# EAGLE design 526_outin_pico_lego (EAGLE 9.6.2)
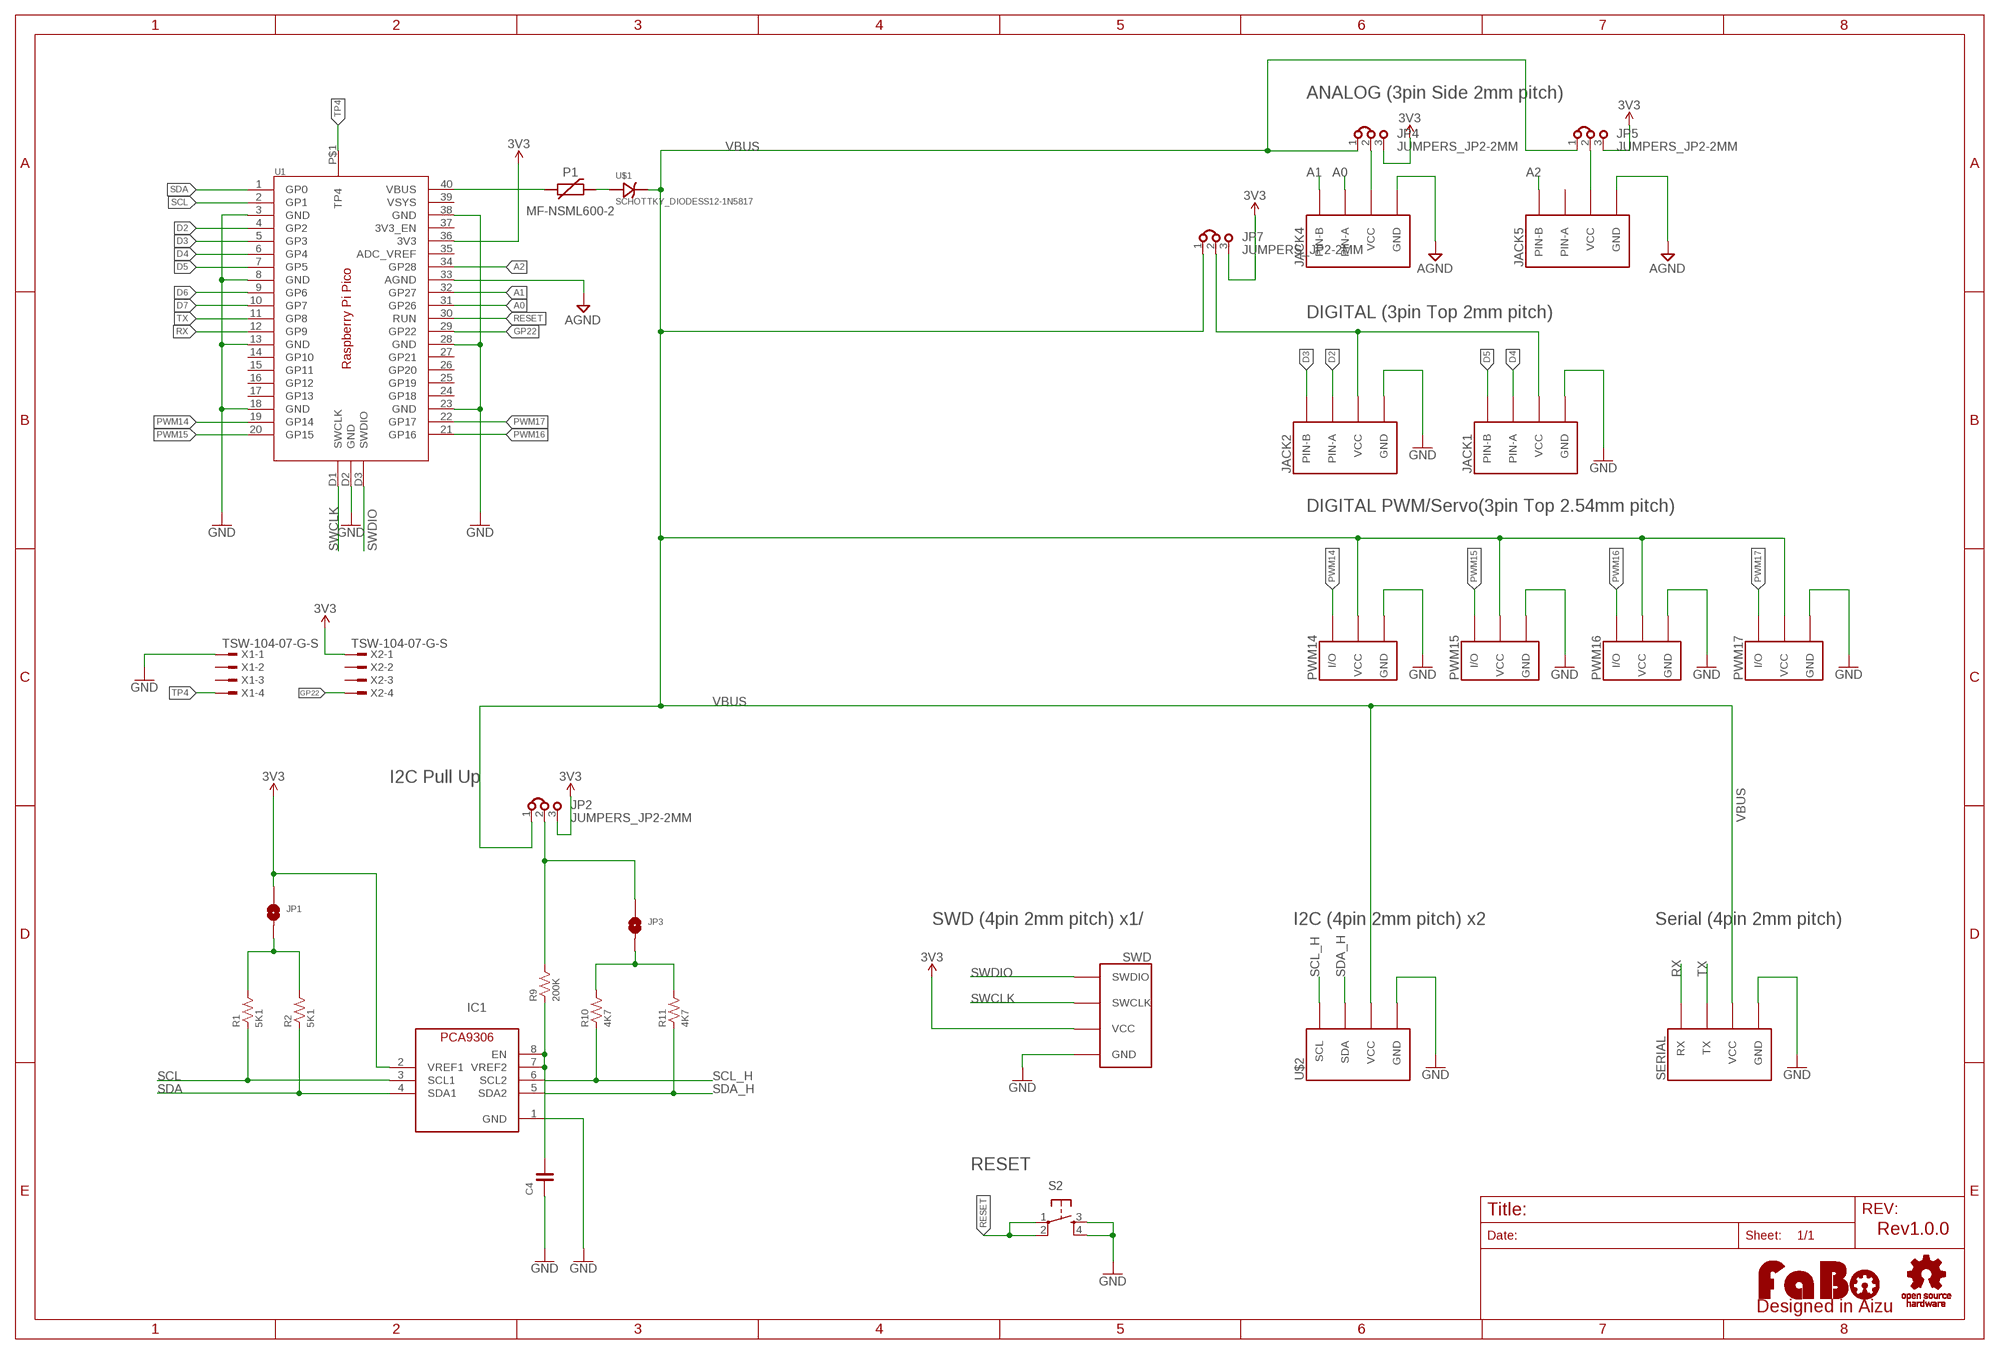
[diagram p0: schematic, sheet 1]

## Parts
C4  CAPACITOR-0603_NARROW  [0603-NARROW]
IC1  PCA9306_SSOP  [8PIN-SSOP]
JACK1  MODULAR-JACK-6P  [7002-6PXC-X]
JACK2  MODULAR-JACK-6P  [7002-6PXC-X]
JACK4  MODULAR-JACK-6P  [7002-6PXC-X]
JACK5  MODULAR-JACK-6P  [7002-6PXC-X]
JP1  SMD-JUMPER-2_SHORT  [SMD-JUMPER-2-SHORT]
JP2  JUMPERS_JP2-2MM  [JUMPERS_JP2-2MM]
JP3  SMD-JUMPER-2_SHORT  [SMD-JUMPER-2-SHORT]
JP4  JUMPERS_JP2-2MM  [JUMPERS_JP2-2MM]
JP5  JUMPERS_JP2-2MM  [JUMPERS_JP2-2MM]
JP7  JUMPERS_JP2-2MM  [JUMPERS_JP2-2MM]
LOGO1  LOGO_OSHW-M_BOTTOM  [LOGO_OSHW_M_BOTTOM]
LOGO2  LOGO_FABO-M  [LOGO_FABO_M]
P1  MF-NSML600-2  POLYSWITCH1206  [1206]
PWM14  FABO_BRICK_3PIN-HEADER  [FABO_BRICK_3PIN_HEADER]
PWM15  FABO_BRICK_3PIN-HEADER  [FABO_BRICK_3PIN_HEADER]
PWM16  FABO_BRICK_3PIN-HEADER  [FABO_BRICK_3PIN_HEADER]
PWM17  FABO_BRICK_3PIN-HEADER  [FABO_BRICK_3PIN_HEADER]
R1  5K1  RESISTOR-0603  [0603]
R2  5K1  RESISTOR-0603  [0603]
R9  200K  RESISTOR-0603  [0603]
R10  4K7  RESISTOR-0603  [0603]
R11  4K7  RESISTOR-0603  [0603]
S2  TACT-SWITCH-SMD_KMR2  [KMR2]
SERIAL  FABO_BRICK_SERIAL-S04B-PASK-2_LONG  [FABO_BRICK_SERIAL_S04B-PASK-2_LONG]
SWD  FABO-SWD-4PIN  [FABO_BRICK_SWD_B04B-PASK-1_SILK]
U1  RASPBERRY_PI_PICORASPBERRY_PI_PICO_SMD_PDM  [RASPBERRY_PI_PICO_SMD_PDM]
U$1  SCHOTTKY_DIODESS12-1N5817  [DO-214AC]
U$2  MODULAR-JACK-6P-I2C  [7002-6PXC-X]
X1  TSW-104-07-G-S  [TSW-104-XX-G-S]
X2  TSW-104-07-G-S  [TSW-104-XX-G-S]

## Nets
3V3: IC1.2(VREF1) JP1.1 JP2.3 JP4.3 JP5.3 JP7.3 SWD.VCC U1.36(3V3) X2.1
A0: JACK4.5(PIN-A) U1.31(GP26)
A1: JACK4.6(PIN-B) U1.32(GP27)
A2: JACK5.6(PIN-B) U1.34(GP28)
AGND: JACK4.1(GND) JACK5.1(GND) U1.33(AGND)
D2: JACK2.5(PIN-A) U1.4(GP2)
D3: JACK2.6(PIN-B) U1.5(GP3)
D4: JACK1.5(PIN-A) U1.6(GP4)
D5: JACK1.6(PIN-B) U1.7(GP5)
D6: U1.9(GP6)
D7: U1.10(GP7)
GND: C4.1 IC1.1(GND) JACK1.1(GND) JACK2.1(GND) PWM14.GND PWM15.GND PWM16.GND PWM17.GND S2.3 S2.4 SERIAL.GND SWD.GND U1.3(GND) U1.8(GND) U1.13(GND) U1.18(GND) U1.23(GND) U1.28(GND) U1.38(GND) U1.D2(GND) U$2.1(GND) X1.1
GP22: U1.29(GP22) X2.4
N$2: JACK5.3(VCC) JP5.2
N$3: JP1.2 R1.2 R2.2
N$4: JACK4.3(VCC) JP4.2
N$5: JACK1.3(VCC) JACK2.3(VCC) JP7.2
N$8: P1.P$2 U$1.CATHODE(ANODE)
N$10: JP2.2 JP3.1 R9.2
N$11: JP3.2 R10.2 R11.2
N$12: C4.2 IC1.7(VREF2) IC1.8(EN) R9.1
PWM14: PWM14.I/O U1.19(GP14)
PWM15: PWM15.I/O U1.20(GP15)
PWM16: PWM16.I/O U1.21(GP16)
PWM17: PWM17.I/O U1.22(GP17)
RESET: S2.1 S2.2 U1.30(RUN)
RX: SERIAL.RX U1.12(GP9)
SCL: IC1.3(SCL1) R1.1 U1.2(GP1)
SCL_H: IC1.6(SCL2) R10.1 U$2.4(SCL)
SDA: IC1.4(SDA1) R2.1 U1.1(GP0)
SDA_H: IC1.5(SDA2) R11.1 U$2.5(SDA)
SWCLK: SWD.SWCLK U1.D1(SWCLK)
SWDIO: SWD.SWDIO U1.D3(SWDIO)
TP4: U1.P$1(TP4) X1.4
TX: SERIAL.TX U1.11(GP8)
VBUS: JP2.1 JP4.1 JP5.1 JP7.1 PWM14.VCC PWM15.VCC PWM16.VCC PWM17.VCC SERIAL.VCC U$1.ANODE(CATHODE) U$2.3(VCC)
VS: P1.P$1 U1.40(VBUS)
Unconnected: JACK5.5(PIN-A) U1.14(GP10) U1.15(GP11) U1.16(GP12) U1.17(GP13) U1.24(GP18) U1.25(GP19) U1.26(GP20) U1.27(GP21) U1.35(ADC_VREF) U1.37(3V3_EN) U1.39(VSYS) X1.2 X1.3 X2.2 X2.3

## Notes on the sheet
- ANALOG (3pin Side 2mm pitch)
- DIGITAL (3pin Top 2mm pitch)
- DIGITAL PWM/Servo(3pin Top 2.54mm pitch)
- I2C Pull Up
- SWD (4pin 2mm pitch) x1/ | I2C (4pin 2mm pitch) x2 | Serial (4pin 2mm pitch)
- RESET
- Rev1.0.0

## Library data of the parts
C4 = FaBo-Capacitor:CAPACITOR: CAPACITOR
IC1 = FaBo-LevelTranslator:PCA9306
JACK1 JACK2 JACK4 JACK5 = FaBo-Connetor:MODULAR-JACK-6P
JP1 JP3 = FaBo-PIN:SMD-JUMPER-2
JP2 JP4 JP5 JP7 = 52101-101-REV-A_v16:JUMPERS_JP2-: Jumper/Bridge
LOGO1 = FaBo-Logo:LOGO_OSHW
LOGO2 = FaBo-Logo:LOGO_FABO
P1 = FaBo-Supply:POLYSWITCH
PWM14-PWM17 = FaBo-Template:FABO_BRICK_3PIN: FaBo Brick 3pin
R1 R2 R9-R11 = FaBo-Resistors:RESISTOR: RESISTOR
S2 = FaBo-Switch:TACT-SWITCH: Part No Maker Datasheet Distributor 1273HA-160G-G SWITRONIC Catalog <http://www.switronic.com/uploads/images/A10.gif> Akizuki <http://akizukidenshi.com/catalog/g/gP-02561/> DTS-6-V Cosland DTS 6 Series <http://www.cosland.com/newproduct/DTS%20SERIES.pdf> Akizuki <http://akizukidenshi.com/catalog/g/gP-03647/> KMR2 C&K KMR2 SERIES <https://www.ckswitches.com/products/switches/product-details/Tactile/KMR2/> Octoparts Result <https://octopart.com/search?q=KMR2&start=0> TSHA-T-XB2-19E TOP UP INDUSTORY TSHA-T <http://www.top-up.com.tw/front/bin/ptdetail.phtml?Part=TSHA-T> Akizuki <http://akizukidenshi.com/catalog/g/gP-09361/>
SERIAL = FaBo-Template:FABO_BRICK_SERIAL: FaBo Brick Serial
SWD = FaBo-Connetor:FABO-SWD-4PIN
U1 = FaBo-Boards:RASPBERRY_PI_PICO
U$1 = FaBo-Diode:SCHOTTKY_DIODE
U$2 = FaBo-Connetor:MODULAR-JACK-6P-I2C
X1 X2 = con-samtec:TSW-104-*-G-S: THROUGH-HOLE .025" SQ POST HEADER Source: Samtec TSW.pdf; MF: Samtec Inc.; MPN: TSW-104-07-G-S

## Board
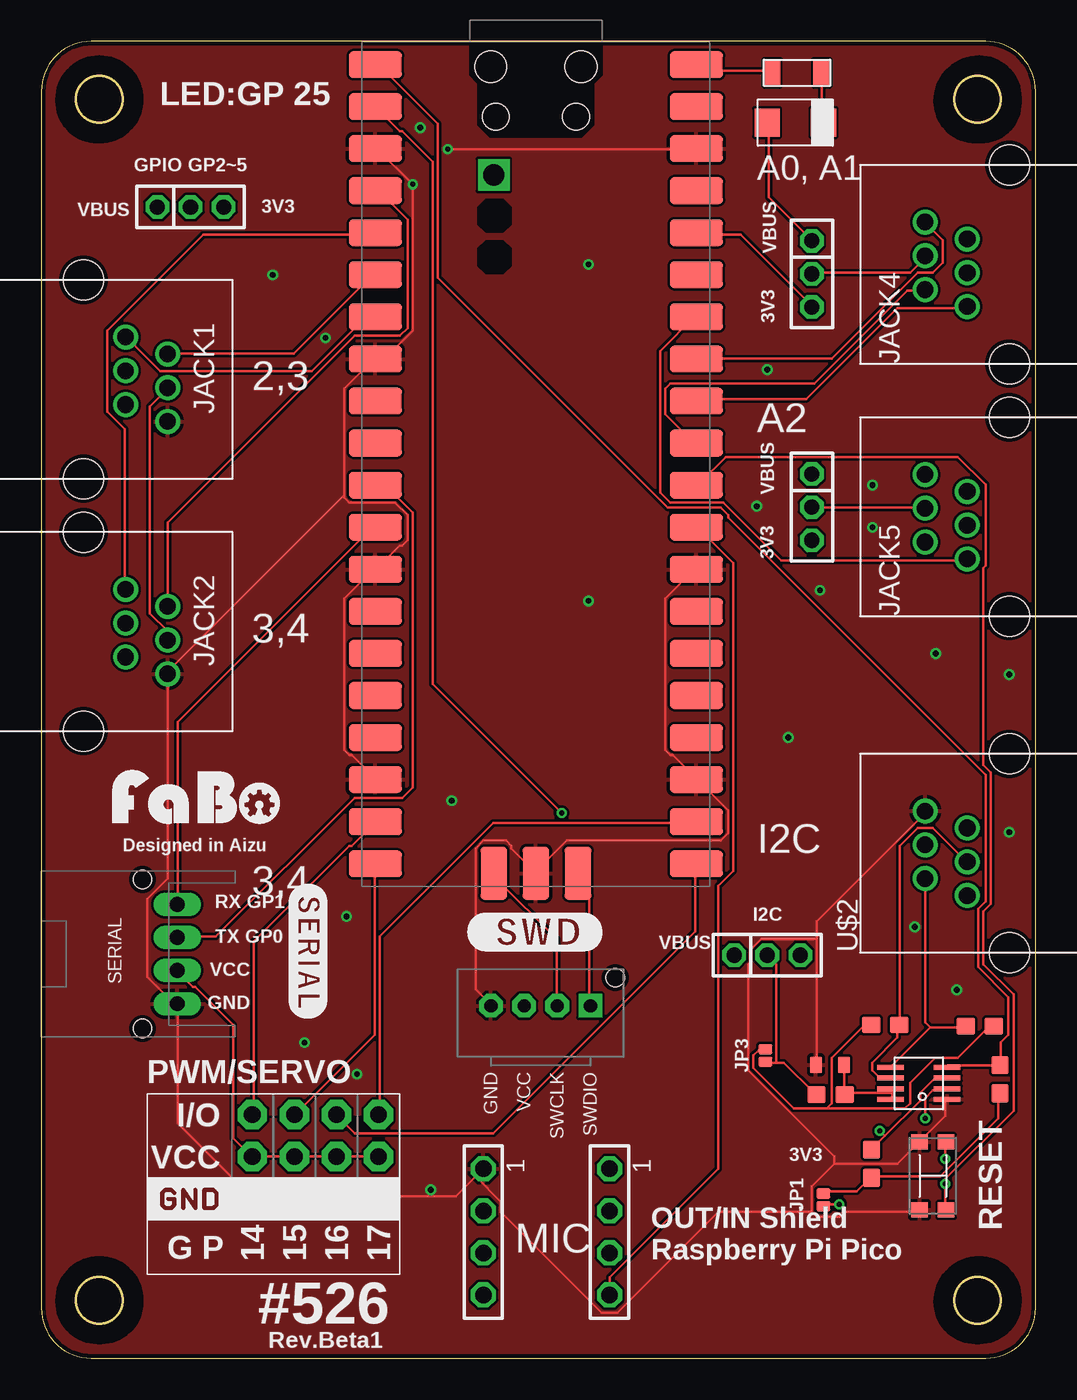
[diagram p1: board, top side]
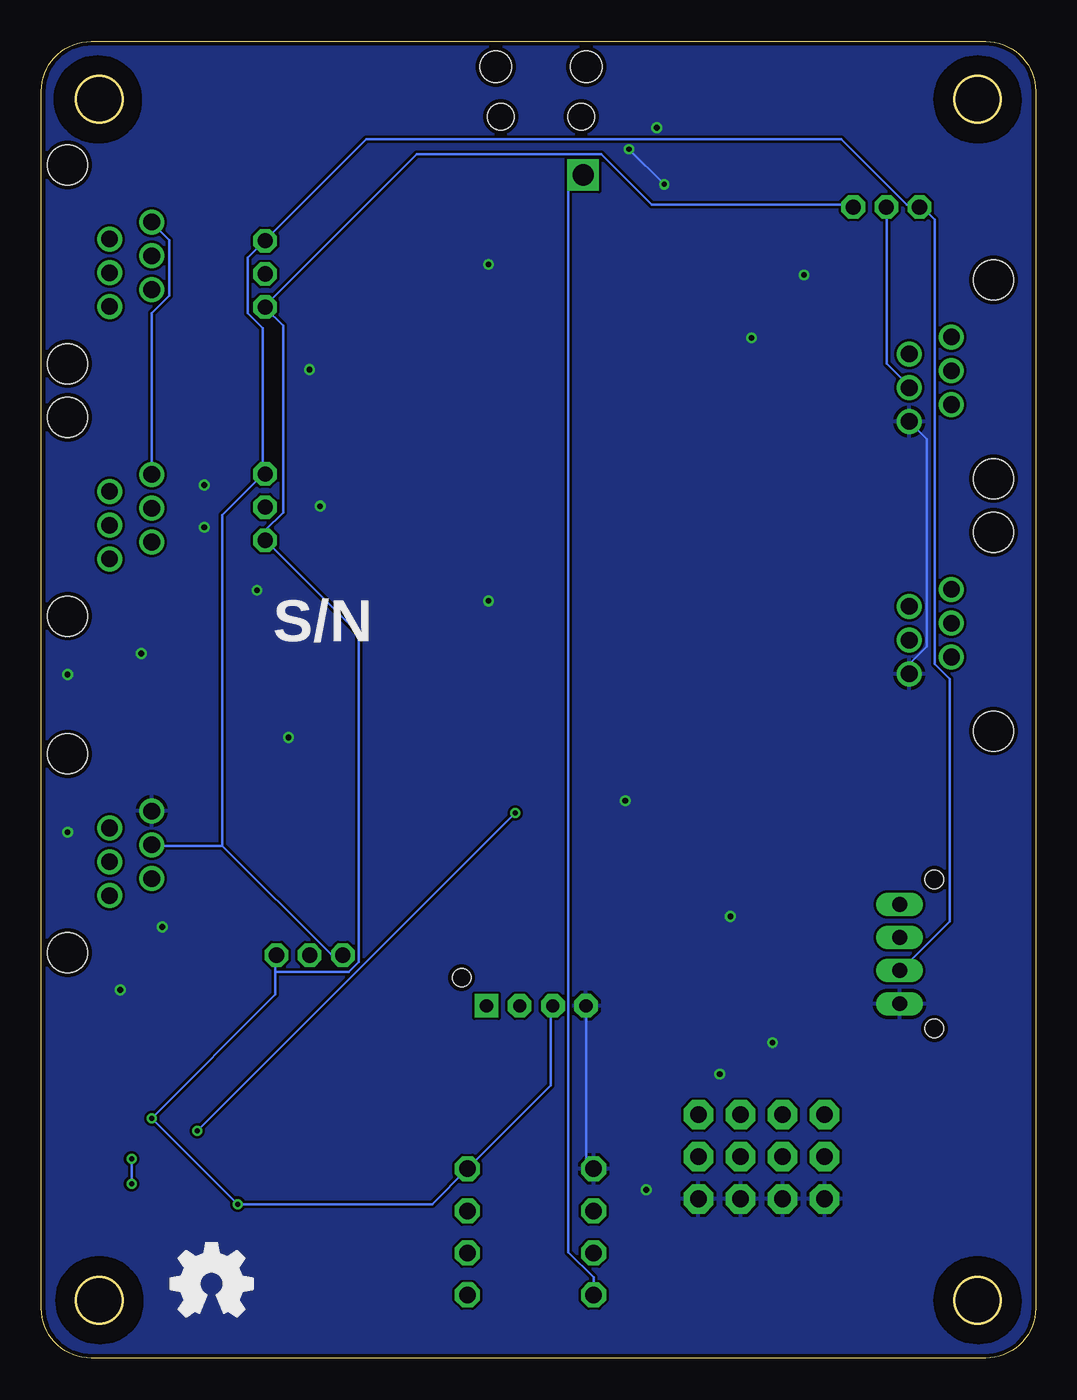
[diagram p2: board, bottom side, seen from below]

Size 60 x 79.5 mm. Coordinates in mm from the lower left corner, seen from the top.
Outline: 57,79.5 3,79.5 arc90 0,76.5 0,3 arc90 3,0 57,0 arc90 60,3 60,76.5 arc90 57,79.5
Outline: circle at 3.5,76 radius 1.4
Outline: circle at 56.5,76 radius 1.4
Outline: circle at 3.5,3.5 radius 1.4
Outline: circle at 56.5,3.5 radius 1.4
Copper layers (1*16): Top 0.035mm / dielectric 1.6mm / Bottom 0.035mm
Design rules "PCBway": minimum track width 6mil, minimum drill 12mil, track to track 6mil, track to pad 6mil, pad to pad 6mil, via to via 6mil, smd to smd 6mil, copper to edge 10mil, drill to drill 10mil, minimum pad ring 10mil, minimum via ring 6mil, stop-mask expansion 2mil, vias tented up to drill 100mil, thermal gap 8mil
tRestrict: area 53.9,0.9 to 59.1,6.1; area 53.9,73.4 to 59.1,78.6; area 0.9,73.4 to 6.1,78.6; area 0.9,0.9 to 6.1,6.1; 2 lines
bRestrict: area 53.9,0.9 to 59.1,6.1; area 0.9,73.4 to 6.1,78.6; area 54,73.4 to 59.2,78.6; area 0.9,0.9 to 6.1,6.1

### Footprints (pad centres in the part's own frame; a part is rotated, then mirrored left to right if it is on the bottom)
0603-NARROW = smd 0.71 x 1: 1 -0.85,0; 2 0.85,0
8PIN-SSOP = smd 0.3 x 1.6: 1 -0.975,-1.7; 2 -0.325,-1.7; 3 0.325,-1.7; 4 0.975,-1.7; 5 0.975,1.7; 6 0.325,1.7; 7 -0.325,1.7; 8 -0.975,1.7
7002-6PXC-X = drill 1: 1 2.55,5.08; 2 1.53,2.54; 3 0.51,5.08; 4 -0.51,2.54; 5 -1.53,5.08; 6 -2.55,2.54 | hole 2.4: -6,0; 6,0
SMD-JUMPER-2-SHORT = smd 0.61 x 0.838: 1 -0.381,0; 2 0.381,0
JUMPERS_JP2-2MM = drill 0.914 octagon: 1 -2,0; 2 0,0; 3 2,0
1206 = smd 1 x 1.6: P$1 -1.5,0; P$2 1.5,0
FABO_BRICK_3PIN_HEADER = drill 1 pad 1.778 octagon: GND -2.54,0; I/O 2.54,0; VCC 0,0
0603 = smd 1.1 x 1: 1 -0.85,0; 2 0.85,0
KMR2 = smd 0.9 x 1: 1 -2.05,0.8; 2 2.05,0.8; 3 2.05,-0.8; 4 -2.05,-0.8
FABO_BRICK_SERIAL_S04B-PASK-2_LONG = drill 0.9 pad 1.422 long: GND -3,0; RX 3,0; TX 1,0; VCC -1,0 | hole 1.1: 4.5,2.1; -4.5,2.1
FABO_BRICK_SWD_B04B-PASK-1_SILK = drill 0.8 pad 1.422 octagon: GND -3,0; SWCLK 1,0; VCC -1,0 | drill 0.8 pad 1.422 square: SWDIO 3,0 | hole 1.1: 4.5,1.7
RASPBERRY_PI_PICO_SMD_PDM = smd 3.2 x 1.6: 1 -9.69,25.4; 2 -9.69,22.86; 3 -9.69,20.32; 4 -9.69,17.78; 5 -9.69,15.24; 6 -9.69,12.7; 7 -9.69,10.16; 8 -9.69,7.62; 9 -9.69,5.08; 10 -9.69,2.54; 11 -9.69,0; 12 -9.69,-2.54; 13 -9.69,-5.08; 14 -9.69,-7.62; 15 -9.69,-10.16; 16 -9.69,-12.7; 17 -9.69,-15.24; 18 -9.69,-17.78; 19 -9.69,-20.32; 20 -9.69,-22.86; 21 9.69,-22.86; 22 9.69,-20.32; 23 9.69,-17.78; 24 9.69,-15.24; 25 9.69,-12.7; 26 9.69,-10.16; 27 9.69,-7.62; 28 9.69,-5.08; 29 9.69,-2.54; 30 9.69,0; 31 9.69,2.54; 32 9.69,5.08; 33 9.69,7.62; 34 9.69,10.16; 35 9.69,12.7; 36 9.69,15.24; 37 9.69,17.78; 38 9.69,20.32; 39 9.69,22.86; 40 9.69,25.4 | smd 1.6 x 3.2: D1 -2.54,-23.43; D2 0,-23.43; D3 2.54,-23.43 | drill 1.27 square: P$1 -2.54,18.733 | hole 1.9: 2.725,25.27; -2.725,25.27 | hole 1.6: 2.425,22.24; -2.425,22.24
DO-214AC = smd 1.52 x 1.68: ANODE 1.7,0; CATHODE -1.7,0
TSW-104-XX-G-S = drill 1 pad 1.5 octagon: 1 3.81,0; 2 1.27,0; 3 -1.27,0; 4 -3.81,0

### Placement (x,y rotation side)
C4  47.6,17.7 0 top
IC1  52.96,16.59 90 top
JACK1  2.54,59.1 270 top
JACK2  2.54,43.86 270 top
JACK4  58.42,66.04 90 top
JACK5  58.42,50.8 90 top
JP1  47.2,9.55 90 top
JP2  43.81,24.33 0 top
JP3  43.7,18.27 90 top
JP4  46.5,65.46 270 top
JP5  46.5,51.38 270 top
JP7  9,69.5 0 top
LOGO1  49.72,4.49 0 top
LOGO2  9.34,31.89 0 top
P1  45.6,77.6 0 top
PWM14  12.72,12.15 90 top
PWM15  15.27,12.15 90 top
PWM16  17.8,12.15 90 top
PWM17  20.34,12.15 90 top
R1  50.1,11.74 270 top
R2  57.86,16.84 270 top
R9  47.63,15.91 180 top
R10  50.93,20.12 180 top
R11  56.63,20.05 0 top
S2  53.8,11 270 top
SERIAL  8.2,24.4 90 top
SWD  30.14,21.27 0 top
U1  29.84,52.7 0 top
U$1  45.5,74.6 180 top
U$2  58.42,30.48 90 top
U$19  [LOGO_SILK_GND]  7.01,8.35 0 top
X1  26.67,7.62 90 top
X2  34.29,7.62 90 top

### Tracks (layer width: path | path; a pad name or v marks a point on that pad's centre or on a via)
3V3  (via drill 0.3)
  Top 0.152: v48.16,9.3 47.24,9.3 JP1.1 | v53.34,14.48 53.34,15.7 53.8,16.15 54.56,16.15 IC1.2 | U1.36 39.62,67.82 42.22,67.82 46.48,63.55 JP4.3
  Bottom 0.152: SWD.VCC 29.26,21.18 29.26,16.46 X2.1 36.42,9.3 v48.16,9.3 v53.34,14.48 45.87,21.95 45.87,23.32 | 45.87,23.32 45.87,24.23 JP2.3 | JP7.3 11.12,69.65 23.16,69.65 26.21,72.69 37.34,72.69 46.48,63.55 JP4.3 46.48,63.4 45.41,62.33 45.41,51.05 46.48,49.99 46.48,49.53 JP5.3 46.48,49.38 40.84,43.74 40.84,23.93 41.45,23.32 45.87,23.32
  pour Top (no thermals): 31.4,61.4 31.4,62.9 35.4,66.9 35.7,67.2 36.2,67.2 37.4,66 37.6,65.8 37.6,65.4 37.6,65.2 33.8,61.4 33.3,60.9 32,60.9 31.9,60.9
  pour Bottom (no thermals): 31.1,61.1 31.1,62.8 35.4,67.1 35.5,67.2 36.3,67.2 37.5,66 37.5,65.2 36.7,64.4 33,60.7 31.6,60.7 31.5,60.7
A0
  Top 0.152: JACK4.5 53.34,64.47 52.27,64.47 46.63,58.83 37.95,58.83 37.64,58.52 37.64,57 39.47,55.17 U1.31
A1
  Top 0.152: JACK4.6 55.78,63.4 51.66,63.4 46.18,57.91 39.62,57.91 U1.32
A2
  Top 0.152: JACK5.6 55.78,48.16 44.65,48.16 41.15,51.66 37.95,51.66 37.34,52.27 37.34,60.81 39.47,62.94 U1.34
AGND
  Top 0.152: U1.33 39.62,60.35 47.7,60.35 52.88,65.53 53.8,65.53 54.41,66.14 54.41,67.51 JACK4.1
  Bottom 0.152: JACK5.1 53.34,63.09 52.27,64.16 52.27,67.51 JACK4.1
D2
  Top 0.152: JACK2.5 7.62,50.44 18.9,61.72 21.64,61.72 22.1,62.18 22.1,68.73 20.27,70.56 U1.4
D3
  Top 0.152: JACK2.6 5.03,46.48 5.03,56.08 3.96,57.15 3.96,62.03 9.75,67.82 20.12,67.82 U1.5
D4
  Top 0.152: JACK1.5 7.62,60.66 15.24,60.66 20.12,65.53 U1.6
D5
  Top 0.152: JACK1.6 5.18,61.57 7.16,59.59 16.31,59.59 19.51,62.79 20.12,62.79 U1.7
GND  (via drill 0.3, 0.35)
  Top 0.152: U1.18 20.12,35.05 18.75,36.42 18.59,36.42 18.29,36.73 18.29,45.87 20.12,47.7 U1.13 20.27,47.7 21.64,49.07 21.79,49.07 22.1,49.38 22.1,50.9 21.34,51.66 18.59,51.66 18.29,51.97 18.29,52.12 | U1.3 20.27,73 v22.4,70.87 22.4,62.03 20.73,60.35 20.27,60.35 U1.8 20.12,60.35 18.29,58.52 18.29,52.12 | v24.54,73 39.47,73 U1.38 | 18.29,52.12 7.62,41.45 JACK2.1 7.62,28.96 6.4,27.74 6.4,23.01 8.08,21.34 SERIAL.GND 8.23,21.34 8.23,14.17 12.65,9.75 PWM14.GND 12.8,9.6 15.24,9.6 PWM15.GND 15.39,9.6 17.68,9.6 PWM16.GND 17.83,9.6 20.27,9.6 PWM17.GND 20.42,9.75 24.99,9.75 26.21,10.97 | 46.48,8.84 46.79,8.53 48.16,8.53 48.46,8.84 52.88,8.84 S2.3 | 46.48,8.84 46.48,10.36 47.85,11.73 | 47.85,11.73 51.66,11.73 52.88,12.95 S2.4 53.03,13.11 54.56,14.63 54.56,15.54 IC1.1 | 46.79,25.3 46.79,26.36 53.34,32.92 U$2.1 | 46.79,25.3 46.79,17.83 C4.1 | 47.85,11.73 47.85,12.19 42.67,17.37 42.67,23.77 42.82,23.93 42.82,24.69 43.43,25.3 46.79,25.3 | U1.28 39.47,47.7 37.64,45.87 37.64,36.73 37.95,36.42 38.1,36.42 39.47,35.05 U1.23 39.62,34.9 41.45,33.07 41.45,31.7 41,31.24 31.7,31.24 29.87,29.41 U1.D2 29.72,29.41 28.35,30.79 28.35,30.94 28.04,31.24 26.67,31.24 26.21,30.79 26.21,22.25 27.13,21.34 SWD.GND | 46.48,8.84 40.84,8.84 34.75,2.74 33.83,2.74 27.74,8.84 27.74,9.45 26.21,10.97 | 26.21,10.97 X1.1
  Bottom 0.152: JACK2.1 7.62,41.91 6.55,42.98 6.55,55.47 JACK1.1 | v22.4,70.87 v24.54,73 | X1.1 27.13,11.89 27.13,21.18 SWD.GND
  other vias: 33.02,45.72 45.09,37.47 24.77,33.66 18.41,26.67 46.99,46.35 13.97,65.41 33.02,66.04 55.24,22.23 52.7,26.04 58.42,31.75 58.42,41.27 53.98,42.55 50.16,50.16 50.16,52.7 43.18,51.44 19.05,17.14 15.88,19.05 23.5,10.16 43.81,59.69 17.14,61.59 22.86,74.3
  pour Top: 0,0 59.69,0 59.69,80.01 0,80.01
  pour Bottom: 0,0 59.69,0 59.69,80.01 0,80.01
GP22
  Top 0.152: X2.4 34.29,4.88 40.84,11.43 40.84,28.5 41.76,29.41 41.76,48.01 39.62,50.14 U1.29
N$2
  Top 0.152: JP5.2 46.63,51.36 53.34,51.36 JACK5.3
N$3
  Top 0.152: JP1.2 47.24,10.06 49.23,10.06 49.99,10.82 R1.2 50.14,10.97 54.25,10.97 57.76,14.48 57.76,15.85 R2.2
N$4
  Top 0.152: JP4.2 46.63,65.53 52.43,65.53 53.34,66.45 JACK4.3
N$5
  Top 0.152: JACK2.3 7.62,43.89 6.55,44.96 6.55,57.45 7.62,58.52 JACK1.3
  Bottom 0.152: JP7.2 8.99,60.05 7.62,58.67 JACK1.3
N$8
  Top 0.152: P1.P$2 47.09,77.57 47.09,74.68 U$1.CATHODE
N$10
  Top 0.152: 44.35,17.83 44.81,17.83 46.63,16 R9.2 | 44.35,17.83 43.74,17.83 JP3.1 | 44.35,17.83 44.35,23.77 43.89,24.23 JP2.2
N$11
  Top 0.152: 47.4,15.09 45.41,15.09 42.98,17.53 42.98,18.29 43.28,18.59 43.59,18.59 JP3.2 | 47.4,15.09 47.7,15.39 47.7,18.14 49.68,20.12 49.99,20.12 R10.2 | 47.4,15.09 52.12,15.09 52.43,15.39 52.43,16.61 53.95,18.14 55.32,18.14 57.15,19.96 57.45,19.96 R11.2
N$12
  Top 0.152: C4.2 48.46,17.68 48.46,16 R9.1 48.62,16 51.36,16 | 51.36,16 51.36,16.15 IC1.7 | 51.36,16 51.36,15.7 IC1.8
PWM14
  Top 0.152: U1.19 20.12,32.31 18.75,30.94 18.59,30.94 12.8,25.15 12.8,14.78 PWM14.I/O
PWM15
  Top 0.152: U1.20 20.12,29.72 20.12,19.51 15.39,14.78 PWM15.I/O
PWM16
  Top 0.152: U1.21 39.47,29.72 39.47,25.76 27.28,13.56 18.9,13.56 17.83,14.63 PWM16.I/O
PWM17
  Top 0.152: U1.22 39.47,32.31 27.28,32.31 20.42,25.45 20.42,14.78 PWM17.I/O
RESET  (via drill 0.3)
  Top 0.152: v54.56,12.04 54.56,12.95 S2.1 | S2.2 54.56,8.99 v54.56,10.52 54.56,10.82 58.67,14.94 58.67,21.95 56.84,23.77 56.84,26.98 57.3,27.43 57.3,35.36 56.84,35.81 56.84,47.7 57,47.85 57,52.73 55.32,54.41 41.3,54.41 39.62,52.73 U1.30
  Bottom 0.152: v54.56,12.04 v54.56,10.52
RX
  Top 0.152: SERIAL.RX 8.23,27.43 8.23,38.41 20.12,50.29 U1.12
SCL  (via drill 0.3)
  Top 0.152: 50.9,13.41 53.03,15.54 53.03,16 53.95,16.92 54.56,16.92 IC1.3 | 50.9,13.41 50.14,12.65 R1.1 | v31.39,32.92 23.62,40.69 23.62,72.24 21.79,74.07 21.64,74.07 20.27,75.44 U1.2 | 50.9,13.41 v50.6,13.72
  Bottom 0.152: v50.6,13.72 v31.39,32.92
SCL_H
  Top 0.152: IC1.6 51.21,16.92 50.6,16.92 50.14,17.37 50.14,17.83 51.66,19.36 51.66,20.12 R10.1 51.82,20.27 51.82,30.94 52.88,32 53.8,32 55.78,30.02 U$2.4
SDA
  Top 0.152: IC1.4 54.71,17.68 57.76,17.68 R2.1 57.91,17.83 57.91,19.05 58.37,19.51 58.37,21.79 56.54,23.62 56.54,27.13 57,27.58 57,35.2 41.45,50.75 41.45,50.9 41,51.36 37.8,51.36 23.93,65.23 23.93,74.52 20.27,78.18 U1.1
SDA_H
  Top 0.152: 53.65,19.96 55.78,19.96 R11.1 | 53.65,19.96 51.36,17.68 IC1.5 | U$2.5 53.34,20.27 53.65,19.96
SWCLK
  Top 0.152: SWD.SWCLK 31.09,21.34 31.09,25.3 27.43,28.96 27.43,29.26 U1.D1
SWDIO
  Top 0.152: SWD.SWDIO 33.07,21.34 33.07,28.65 32.46,29.26 U1.D3
TP4
  Bottom 0.152: X1.4 26.67,4.88 28.19,6.4 28.19,70.56 27.43,71.32 U1.P$1
TX
  Top 0.152: SERIAL.TX 8.23,25.45 10.52,25.45 18.9,33.83 21.79,33.83 22.4,34.44 22.4,51.05 20.88,52.58 20.27,52.58 U1.11
VBUS
  Top 0.152: PWM17.VCC 20.27,12.19 17.83,12.19 PWM16.VCC 17.68,12.19 15.39,12.19 PWM15.VCC 15.24,12.19 12.8,12.19 PWM14.VCC 12.65,12.19 11.58,13.26 11.58,20.12 9.3,22.4 9.14,22.4 8.23,23.32 SERIAL.VCC | U$1.ANODE 43.89,74.52 43.89,70.1 46.48,67.51 JP4.1
  Bottom 0.152: 49.07,30.94 42.52,24.38 41.91,24.38 JP2.1 | 49.07,30.94 53.34,30.94 U$2.3 | 49.07,30.94 49.07,50.9 46.63,53.34 JP5.1 46.63,53.49 46.63,62.18 47.55,63.09 47.55,66.45 46.63,67.36 JP4.1 46.48,67.51 40.39,73.61 11.73,73.61 7.77,69.65 7.01,69.65 JP7.1 6.86,69.49 6.1,68.73 6.1,41.91 5.18,41 5.18,26.36 8.08,23.47 SERIAL.VCC
VS
  Top 0.152: P1.P$1 44.04,77.72 39.93,77.72 39.62,78.03 U1.40

### Text on the board
tPlace: LED:GP 25 | GPIO GP2~5 | A0, A1 | VBUS | 3V3 | VBUS | 3V3 | 2,3 | A2 | VBUS | 3V3 | 3,4 | Designed in Aizu | I2C | 3,4 | RX GP1 | I2C | TX GP0 | VBUS | VCC | GND | PWM/SERVO | I/O | 3V3 | VCC | RESET | 14 | 15 | 16 | 17 | G P | MIC | OUT/IN Shield / Raspberry Pi Pico | #526 | Rev.Beta1
bPlace: S/N
Document: Raspberry Pi Pico Rev.1.0.2